# EAGLE design LT1054+LinierRegurator (EAGLE 7.2.0)
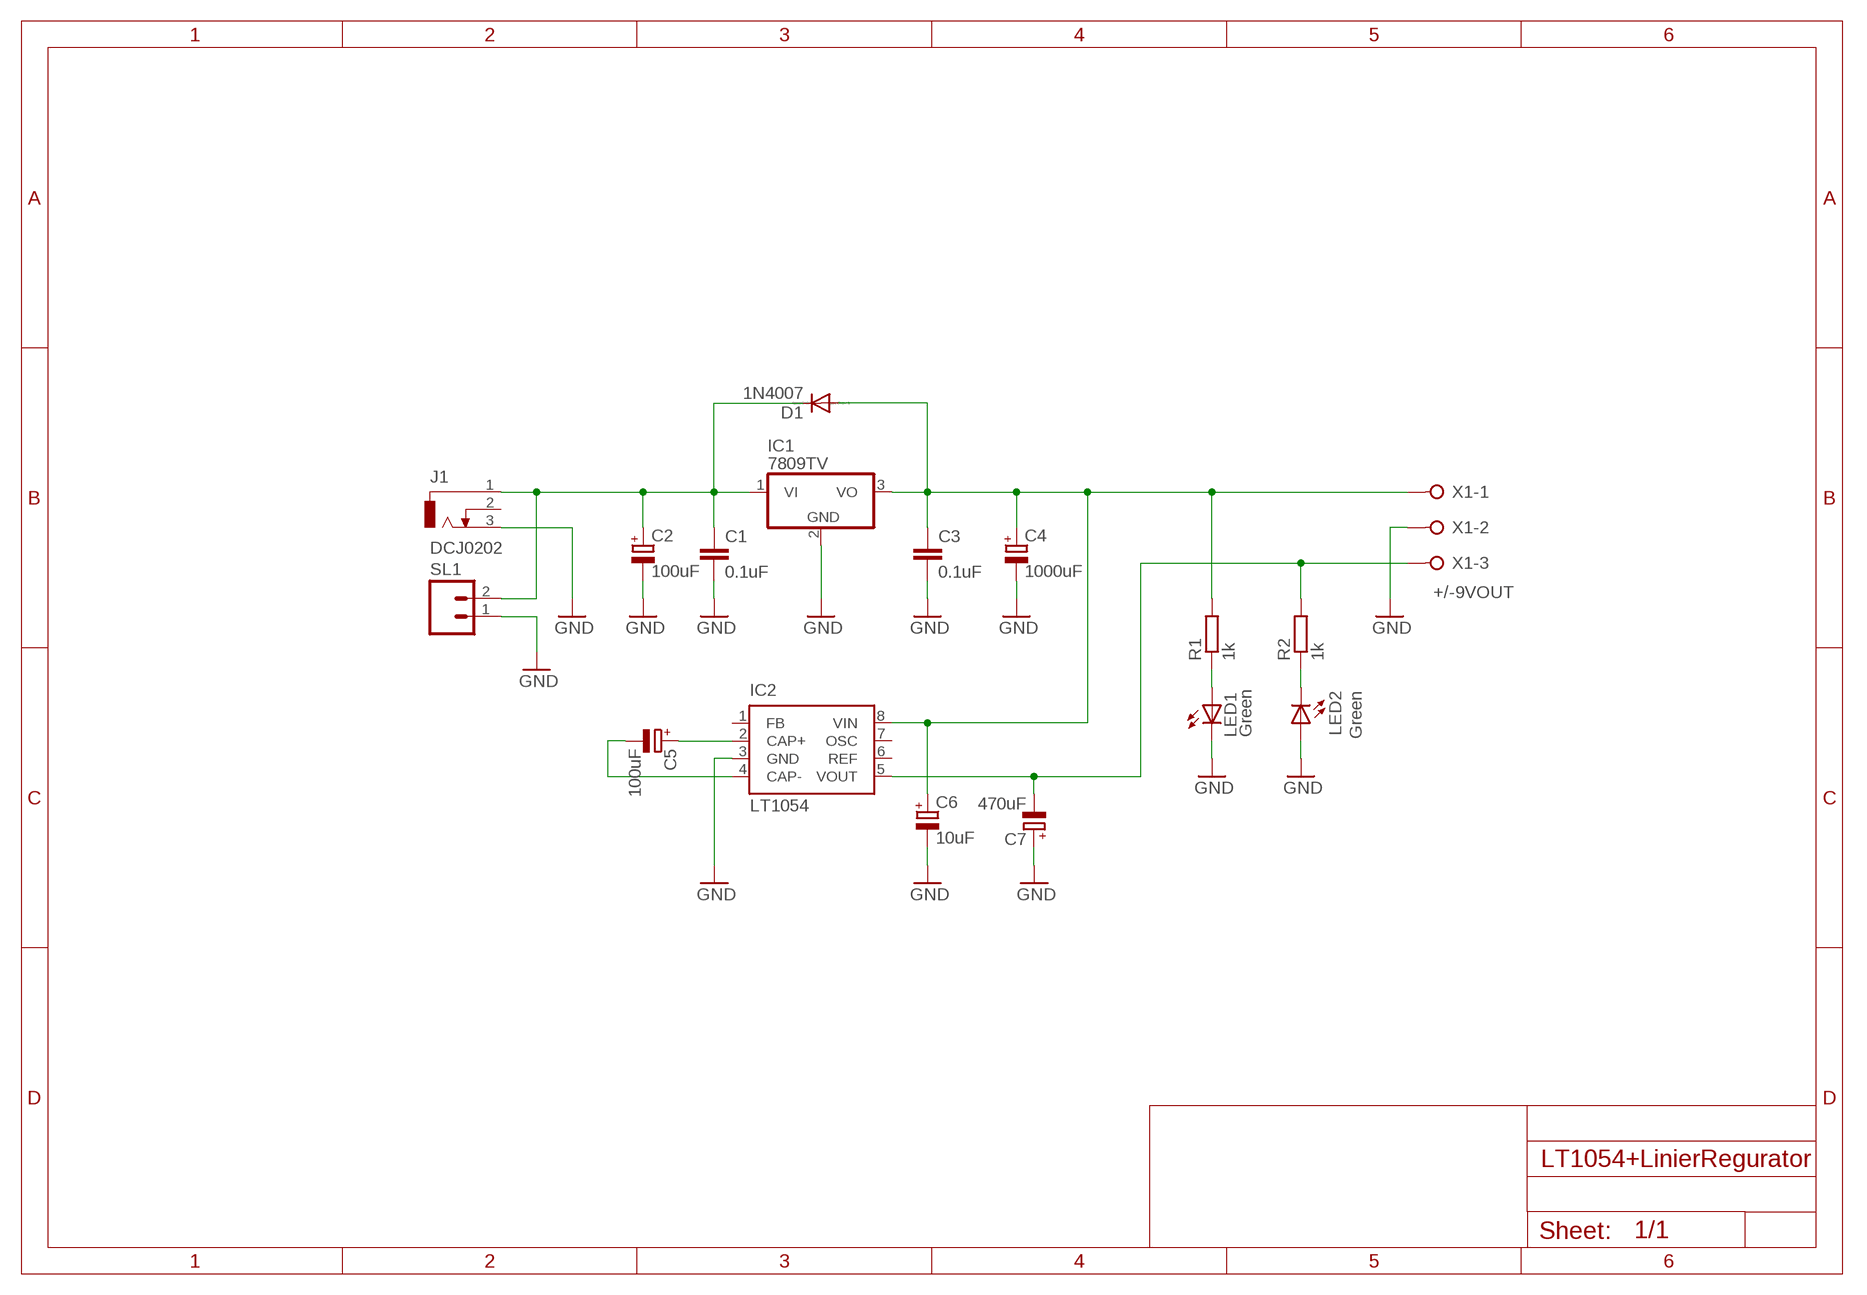
[diagram p0: schematic, sheet 1]

## Parts
C1  0.1uF  C-EU025-024X044  [C025-024X044]
C2  100uF  CPOL-EUE2.5-7  [E2,5-7]
C3  0.1uF  C-EU025-024X044  [C025-024X044]
C4  1000uF  CPOL-EUE5-13  [E5-13]
C5  100uF  CPOL-EUE2.5-7  [E2,5-7]
C6  10uF  CPOL-EUE2.5-5  [E2,5-5]
C7  470uF  CPOL-EUE5-8.5  [E5-8,5]
D1  1N4007  1N4004  [DO41-10]
IC1  7809TV  7805TV  [TO220V]
IC2  LT1054  [DIL8]
J1  DCJ0202  [DCJ0202]
LED1  Green  LED3MM  [LED3MM]
LED2  Green  LED3MM  [LED3MM]
R1  1k  R-EU_0207/7  [0207/7]
R2  1k  R-EU_0207/7  [0207/7]
SL1  M02  [02P]
X1  +/-9VOUT  W237-3E  [W237-3E]

## Nets
GND: C1.2 C2.- C3.2 C4.- C6.- C7.+ IC1.2(GND) IC2.3(GND) J1.3 LED1.K(C) LED2.A SL1.1 X1.2
N$1: C1.1 C2.+ D1.C IC1.1(VI) J1.1 SL1.2
N$2: C3.1 C4.+ C6.+ D1.A IC1.3(VO) IC2.8(VIN) R1.2 X1.1
N$3: C5.- IC2.4(CAP-)
N$4: C5.+ IC2.2(CAP+)
N$5: C7.- IC2.5(VOUT) R2.2 X1.3
N$6: LED1.A R1.1
N$7: LED2.K(C) R2.1
Unconnected: IC2.1(FB) IC2.6(REF) IC2.7(OSC) J1.2

## Library data of the parts
C1 C3 = rcl:C-EU: CAPACITOR, European symbol
C2 C4-C7 = rcl:CPOL-EU: POLARIZED CAPACITOR, European symbol
D1 = diode:1N4004: DIODE general purpose rectifier, 1 A
IC1 = linear:78*: Positive VOLTAGE REGULATOR Source: http://cache.national.com/ds/LM/LM78L05.pdf http://www.fairchildsemi.com/ds/LM/LM7805.pdf
IC2 = mylib2:LT1054
J1 = con-jack:DCJ0202: DC POWER JACK Source: DCJ0202.pdf; OC_FARNELL: unknown; OC_NEWARK: unknown
LED1 LED2 = led:LED: LED OSRAM: - CHIPLED LG R971, LG N971, LY N971, LG Q971, LY Q971, LO R971, LY R971 LH N974, LH R974 LS Q976, LO Q976, LY Q976 LO Q996 - Hyper CHIPLED LW Q18S LB Q993, LB Q99A, LB R99A - SideLED LS A670, LO A670, LY A670, LG A670, LP A670 LB A673, LV A673, LT A673, LW A673 LH A674 LY A675 LS A676, LA A676, LO A676, LY A676, LW A676 LS A679, LY A679, LG A679 - Hyper Micro SIDELED® LS Y876, LA Y876, LO Y876, LY Y876 LT Y87S - SmartLED LW L88C, LW L88S LB L89C, LB L89S, LG L890 LS L89K, LO L89K, LY L89K LS L896, LA L896, LO L896, LY L896 - TOPLED LS T670, LO T670, LY T670, LG T670, LP T670 LSG T670, LSP T670, LSY T670, LOP T670, LYG T670 LG T671, LOG T671, LSG T671 LB T673, LV T673, LT T673, LW T673 LH T674 LS T676, LA T676, LO T676, LY T676, LB T676, LH T676, LSB T676, LW T676 LB T67C, LV T67C, LT T67C, LS T67K, LO T67K, LY T67K, LW E67C LS E67B, LA E67B, LO E67B, LY E67B, LB E67C, LV E67C, LT E67C LW T67C LS T679, LY T679, LG T679 LS T770, LO T770, LY T770, LG T770, LP T770 LB T773, LV T773, LT T773, LW T773 LH T774 LS E675, LA E675, LY E675, LS T675 LS T776, LA T776, LO T776, LY T776, LB T776 LHGB T686 LT T68C, LB T68C - Hyper Mini TOPLED® LB M676 - Mini TOPLED Santana® LG M470 LS M47K, LO M47K, LY M47K Source: http://www.osram.convergy.de LUXEON: - LUMILED® LXK2-PW12-R00, LXK2-PW12-S00, LXK2-PW14-U00, LXK2-PW14-V00 LXK2-PM12-R00, LXK2-PM12-S00, LXK2-PM14-U00 LXK2-PE12-Q00, LXK2-PE12-R00, LXK2-PE12-S00, LXK2-PE14-T00, LXK2-PE14-U00 LXK2-PB12-K00, LXK2-PB12-L00, LXK2-PB12-M00, LXK2-PB14-N00, LXK2-PB14-P00, LXK2-PB14-Q00 LXK2-PR12-L00, LXK2-PR12-M00, LXK2-PR14-Q00, LXK2-PR14-R00 LXK2-PD12-Q00, LXK2-PD12-R00, LXK2-PD12-S00 LXK2-PH12-R00, LXK2-PH12-S00 LXK2-PL12-P00, LXK2-PL12-Q00, LXK2-PL12-R00 Source: www.luxeon.com KINGBRIGHT: KA-3528ASYC Source: www.kingbright.com
R1 R2 = rcl:R-EU_: RESISTOR, European symbol
SL1 = con-amp-quick:M02: AMP QUICK CONNECTOR; OC_FARNELL: unknown; OC_NEWARK: unknown
X1 = con-wago-508:W237-3E: WAGO SREW CLAMP; OC_FARNELL: unknown; OC_NEWARK: unknown

## Board
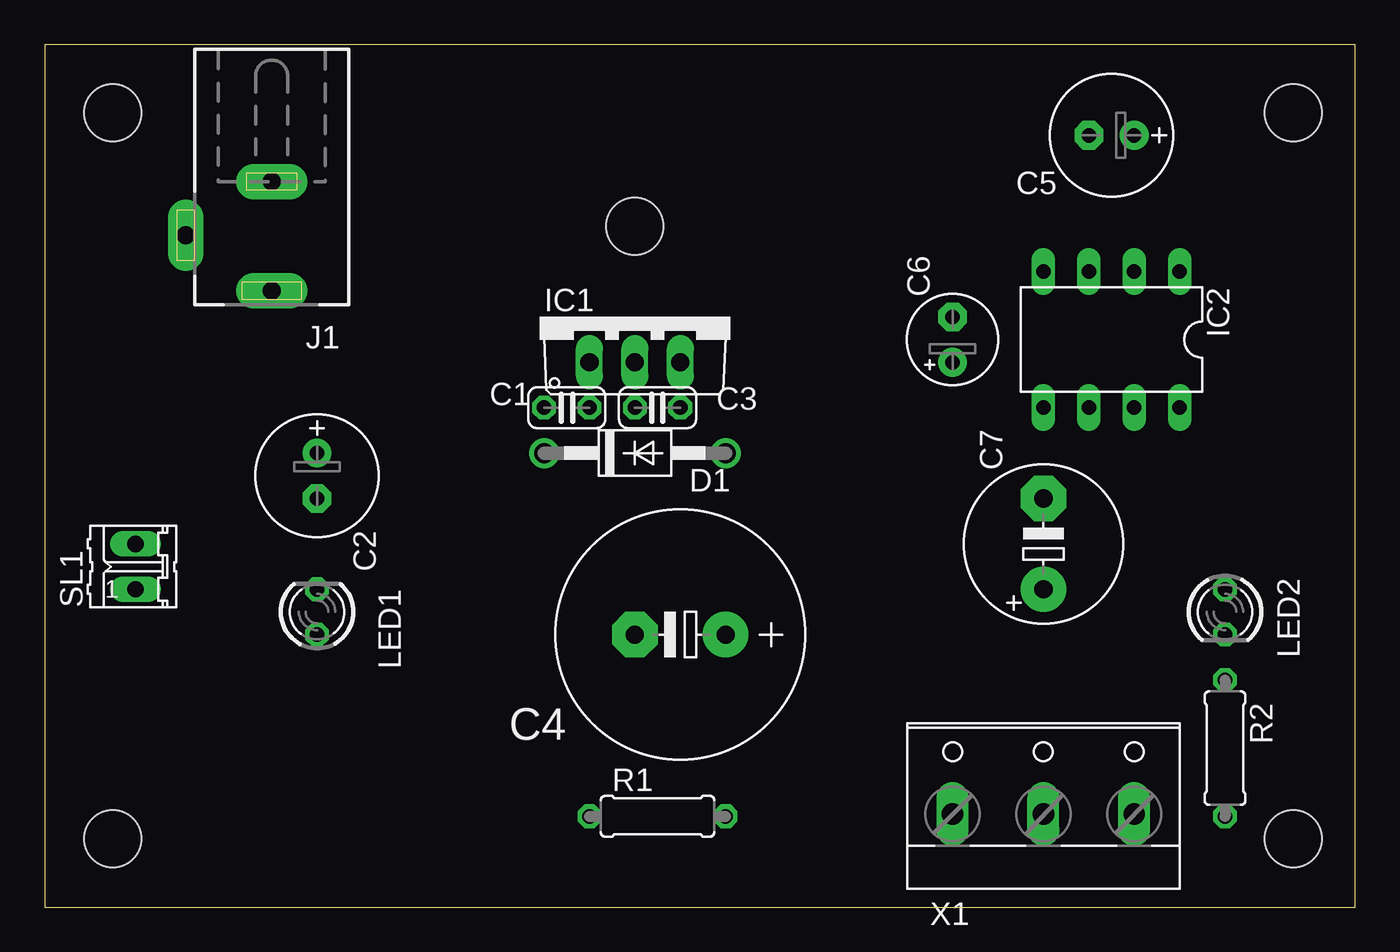
[diagram p1: board, top side]
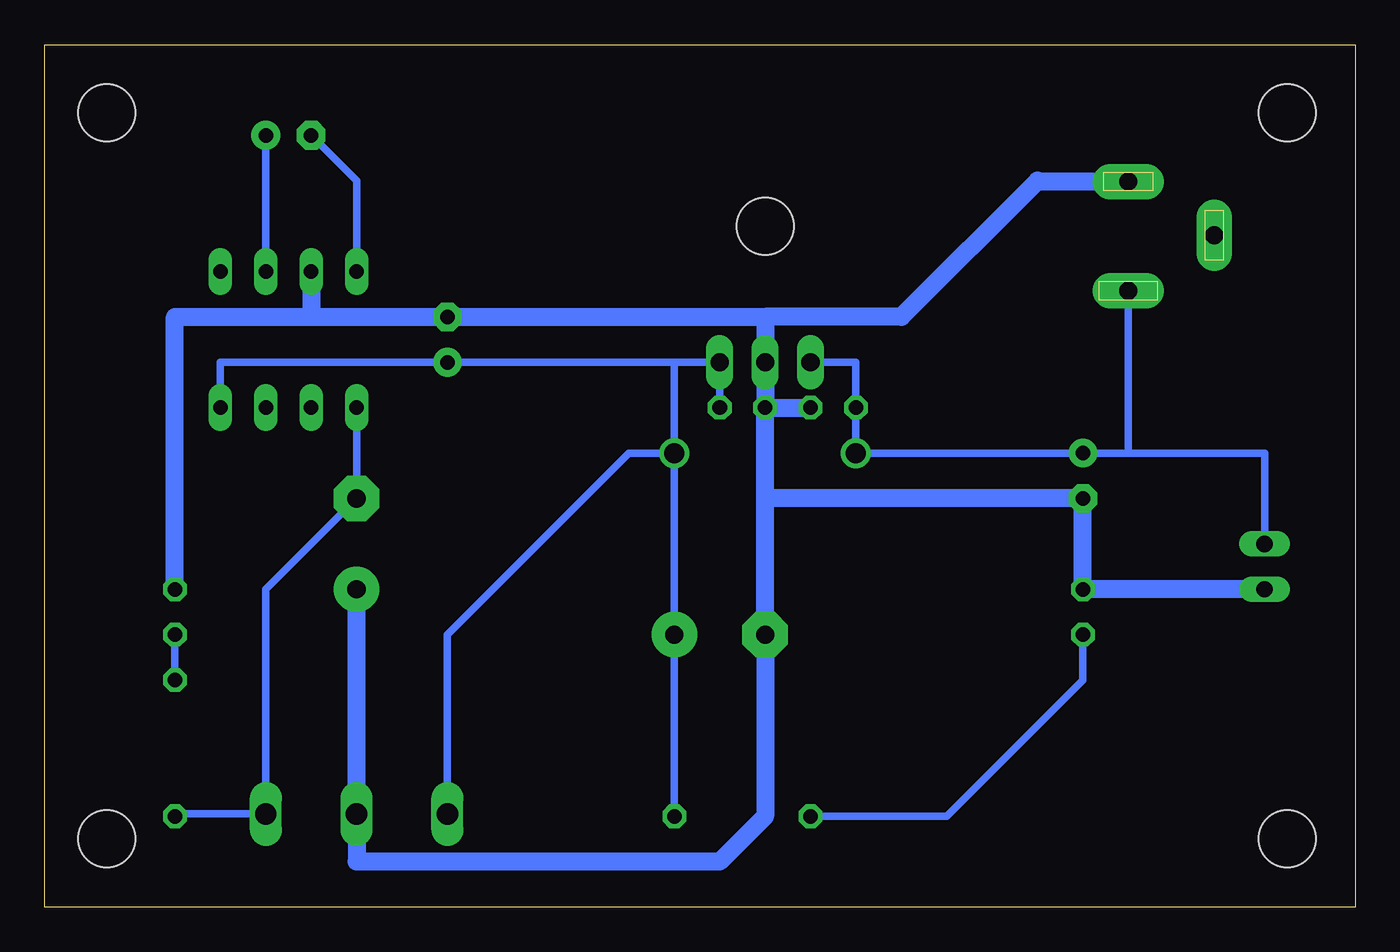
[diagram p2: board, bottom side, seen from below]

Size 73.33 x 48.25 mm. Coordinates in mm from the lower left corner, seen from the top.
Outline: 0,0 73.33,0 73.33,48.25 0,48.25 0,0
Copper layers (1*16): Top 0.035mm / dielectric 1.5mm / Bottom 0.035mm
Design rules "default": minimum track width 10mil, minimum drill 24mil, track to track 8mil, track to pad 8mil, pad to pad 8mil, via to via 8mil, smd to smd 8mil, copper to edge 40mil, drill to drill 8mil, minimum pad ring 10mil, minimum via ring 8mil, stop-mask expansion 4mil, vias tented up to drill 0mil, thermal gap 10mil
Holes 3.2 mm at 3.81,44.45 3.81,3.81 69.85,44.45 69.85,3.81 33.02,38.1
tKeepout: area 21.6,25.4 to 44.5,43.2
bKeepout: area 0,19.1 to 3.8,48.3

### Footprints (pad centres in the part's own frame; a part is rotated, then mirrored left to right if it is on the bottom)
C025-024X044 = drill 0.813 octagon: 1 -1.27,0; 2 1.27,0
E2,5-7 = drill 0.813 pad 1.6: + -1.27,0 | drill 0.813 pad 1.6 octagon: - 1.27,0
E5-13 = drill 1.016 pad 2.54: + -2.54,0 | drill 1.016 pad 2.54 octagon: - 2.54,0
E2,5-5 = drill 0.813 pad 1.6: + -1.27,0 | drill 0.813 pad 1.6 octagon: - 1.27,0
E5-8,5 = drill 1.016 pad 2.54: + -2.54,0 | drill 1.016 pad 2.54 octagon: - 2.54,0
DO41-10 = drill 1.118: A 5.08,0; C -5.08,0
TO220V = drill 1.016 long: 1 -2.54,-2.54; 2 0,-2.54; 3 2.54,-2.54
DIL8 = drill 0.813 long: 1 -3.81,-3.81; 2 -1.27,-3.81; 3 1.27,-3.81; 4 3.81,-3.81; 5 3.81,3.81; 6 1.27,3.81; 7 -1.27,3.81; 8 -3.81,3.81
DCJ0202 = drill 1 pad 2 long: 1 0,3.1; 2 4.8,0; 3 0,-3
LED3MM = drill 0.813 octagon: A -1.27,0; K 1.27,0
0207/7 = drill 0.813 octagon: 1 -3.81,0; 2 3.81,0
02P = drill 0.914 long: 1 -1.27,0; 2 1.27,0
W237-3E = drill 1.194 long: 1 -5.08,-0.635; 2 0,-0.635; 3 5.08,-0.635

### Placement (x,y rotation side)
C1  29.21,27.94 0 top
C2  15.24,24.13 270 top
C3  34.29,27.94 180 top
C4  35.56,15.24 180 top
C5  59.69,43.18 180 top
C6  50.8,31.75 90 top
C7  55.88,20.32 90 top
D1  33.02,25.4 0 top
IC1  33.02,33.02 0 top
IC2  59.69,31.75 180 top
J1  12.7,37.59 180 top
LED1  15.24,16.51 90 top
LED2  66.04,16.51 270 top
R1  34.29,5.08 0 top
R2  66.04,8.89 270 top
SL1  5.08,19.05 90 top
X1  55.88,5.84 0 top

### Tracks (layer width: path | path; a pad name or v marks a point on that pad's centre or on a via)
GND
  Bottom 1.016: C3.2 IC1.2 33.02,33.02 | C3.2 C1.2 | 33.02,22.86 C2.- LED1.K SL1.1 | 33.02,22.86 C3.2 | 33.02,22.86 C4.- 33.02,5.08 35.56,2.54 55.88,2.54 X1.2 C7.+ | 33.02,33.02 C6.- 58.42,33.02 | LED2.A 66.04,33.02 58.42,33.02 | IC2.3 58.42,33.02 | 33.02,33.02 25.4,33.02 17.78,40.64 17.73,40.59 J1.3
N$1
  Bottom 0.406: IC1.1 27.94,30.48 C1.1 D1.C C2.+ 12.7,25.4 | SL1.2 5.08,25.4 12.7,25.4 | J1.1 12.7,25.4
N$2
  Bottom 0.406: C3.1 IC1.3 38.1,30.48 | D1.A 38.1,30.48 | IC2.8 63.5,30.48 C6.+ 38.1,30.48 | D1.A C4.+ | C4.+ 38.1,14.61 | R1.2 C4.+ | X1.1 50.8,15.24 40.64,25.4 D1.A
N$3
  Bottom 0.406: IC2.4 55.88,40.64 C5.-
N$4
  Bottom 0.406: C5.+ IC2.2
N$5
  Bottom 0.406: IC2.5 C7.- 60.96,17.78 X1.3 66.04,5.21 R2.2
N$6
  Bottom 0.406: R1.1 22.86,5.08 15.24,12.7 LED1.A
N$7
  Bottom 0.406: R2.1 LED2.K

### Text on the board
Document: (-) | (+)